# Altium schematic sheet 4. ADC.SchDoc
size A4
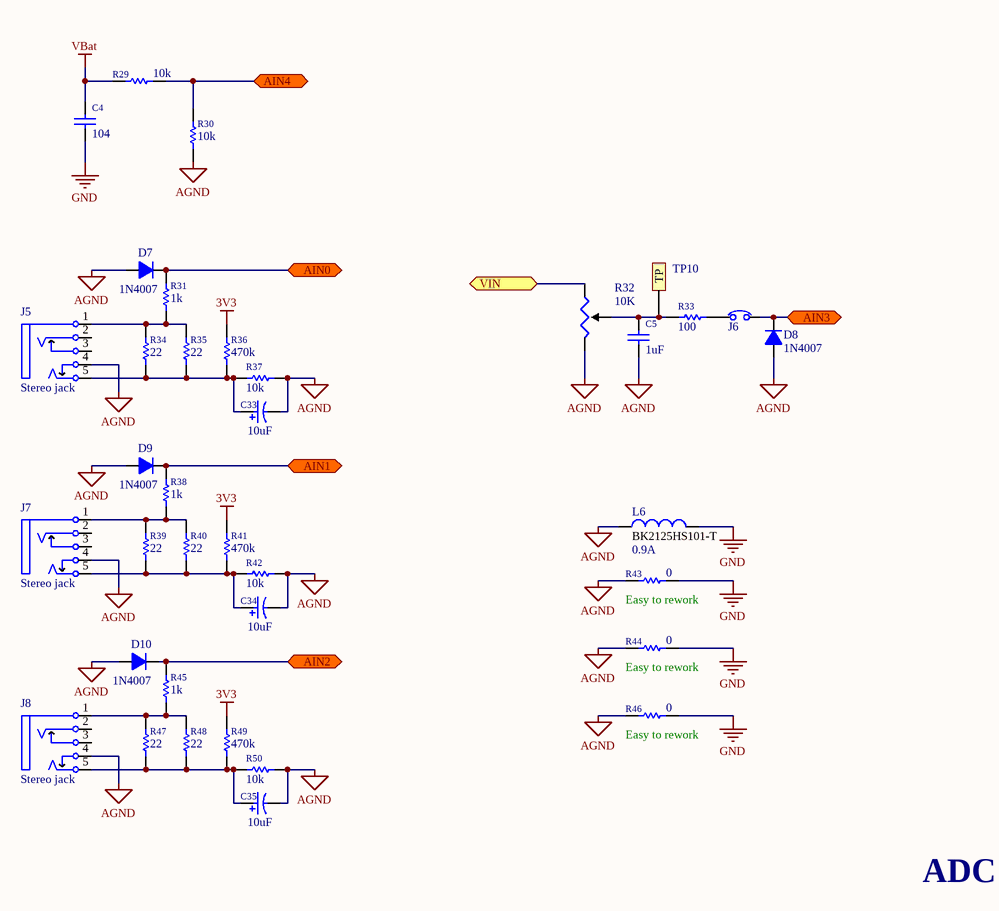
[diagram p0: 4. ADC.SchDoc]

## Parts
C4  104  [sm-0603-c]
C5  value 1uF  [sm-0603-c]  (hidden comment: 104)
C33  value 10uF  [Cap SMD Tant 10u]  (hidden comment: 10u)
C34  value 10uF  [Cap SMD Tant 10u]  (hidden comment: 10u)
C35  value 10uF  [Cap SMD Tant 10u]  (hidden comment: 10u)
D7  1N4007  [SOD-123]
D8  1N4007  [SOD-123]
D9  1N4007  [SOD-123]
D10  1N4007  [SOD-123]
J5  Stereo jack  [Audio Stereo Jack]
J6  jumper selector  [CON.HDR1X2]  (value not drawn)
J7  Stereo jack  [Audio Stereo Jack]
J8  Stereo jack  [Audio Stereo Jack]
L6  Current: 0.9A  [L2012-0805]  (hidden comment: BK2125HS101-T)
R29  10k  [SM-0603-R]
R30  10k  [SM-0603-R]
R31  value 1k  [SM-0603-R]  (hidden comment: 10k)
R32  value 10K  [TRIM Rect]  (hidden comment: Trimmer)
R33  value 100  [SM-0603-R]  (hidden comment: 470k)
R34  value 22  [SM-RES-1206]  (hidden comment: 10k)
R35  22  [SM-0603-R]
R36  value 470k  [SM-0603-R]  (hidden comment: 10k)
R37  value 10k  [SM-0603-R]  (hidden comment: 470k)
R38  value 1k  [SM-0603-R]  (hidden comment: 10k)
R39  value 22  [SM-RES-1206]  (hidden comment: 10k)
R40  22  [SM-0603-R]
R41  value 470k  [SM-0603-R]  (hidden comment: 10k)
R42  value 10k  [SM-0603-R]  (hidden comment: 470k)
R43  0  [R2012-0805]
R44  0  [R2012-0805]
R45  value 1k  [SM-0603-R]  (hidden comment: 10k)
R46  0  [R2012-0805]
R47  value 22  [SM-RES-1206]  (hidden comment: 10k)
R48  22  [SM-0603-R]
R49  value 470k  [SM-0603-R]  (hidden comment: 10k)
R50  value 10k  [SM-0603-R]  (hidden comment: 470k)
TP10  4V3_PG  [TP]  (value not drawn)  (no BOM)

## Ports
AIN0, AIN1, AIN2, AIN3, AIN4, VIN

## Nets
3V3: R36.2 R41.2 R49.2
AGND: C5.2 C33.2 C34.2 C35.2 D7.1(A) D8.1(A) D9.1(A) D10.1(A) J5.4(R2) J7.4(R2) J8.4(R2) L6.1 R30.1 R32.3 R37.1 R42.1 R43.1 R44.1 R46.1 R50.1
GND: C4.2 L6.2 R43.2 R44.2 R46.2
VBat: C4.1 R29.1
AIN0: D7.2(K) R31.2 ; port AIN0
AIN1: D9.2(K) R38.2 ; port AIN1
AIN2: D10.2(K) R45.2 ; port AIN2
AIN3: D8.2(K) J6.2 ; port AIN3
AIN4: R29.2 R30.2 ; port AIN4
VIN: R32.1 ; port VIN
NetC5_1: C5.1 R32.2 R33.2 TP10.1(TP)
NetC33_1: C33.1 J5.5(S2) R34.1 R35.1 R36.1 R37.2
NetC34_1: C34.1 J7.5(S2) R39.1 R40.1 R41.1 R42.2
NetC35_1: C35.1 J8.5(S2) R47.1 R48.1 R49.1 R50.2
NetJ5_1: J5.1(GND) R31.1 R34.2 R35.2
NetJ6_1: J6.1 R33.1
NetJ7_1: J7.1(GND) R38.1 R39.2 R40.2
NetJ8_1: J8.1(GND) R45.1 R47.2 R48.2

Not connected (* = marked no-connect by the designer): J5 2(S1) 3(R1); J7 2(S1) 3(R1); J8 2(S1) 3(R1)

## Notes on the sheet
- (near R43) Easy to rework
- (near R44) Easy to rework
- (near R46) Easy to rework
- ADC

## Library data of the parts
C4 C5 = Capacitor: CAP CER 10000PF 16V 0603; Manufacturer: Taiyo Yuden; Manufacturer P/N: EMK107SD103JA-T; Vendor: DIGIKEY; Vendor P/N: 587-1093-1-ND; Package: 0603; Part: EMK107SD103JA-T; Voltage: 16V
  C4: Value: 104
C33-C35 = Cap_Pol: CAP CER 10UF 6.3V X5R 1206; Manufacturer: Samsung Electro-Mechanics; Manufacturer P/N: CL31A106MQHNNNE; Vendor: DIGIKEY; Vendor P/N: 1276-3045-1-ND; Tollerance: 20%; Voltage: 6.3V; Part: 10u; Package: 1206; DNP: *
D7-D10 = Diode 1N4007: DIODE 100V/1A; Manufacturer: TOSHIBA; Vendor P/N: 1N4007-M7; Voltage: 100V; Current: 1A; Vendor: www.tme.vn; Value: 1N4007; Price: 500 VND; Part: Diode 1N4007; Manufacturer P/N: 1N4007-M7; Package: DO-214AC; DNP: *
J5 J7 J8 = Audio Jack: Stereo audio jack
L6 = Inductor: FERRITE BEAD 100 OHM 0805 1LN; Manufacturer: Taiyo Yuden; Vendor: DIGIKEY; Vendor P/N: 587-1903-1-ND; Res: 100 OHM; Value: BK2125HS101-T; DNP: *; Manufacturer P/N: BK2125HS101-T; Package: 0805; Part: BK2125HS101-T; Price: *
R29-R31 R33-R42 R45 R47-R50 = Resistor: RES SMD 10K OHM 5% 1/10W 0603; Manufacturer: Panasonic Electronic Components; Manufacturer P/N: ERJ-3GEYJ103V; Vendor: DIGIKEY; Vendor P/N: P10KGCT-ND; Tollerance: 5%; Part: 10k; Package: 0603; Power: 1/10W; DNP: *
  R29 R30: Value: 10k
  R35 R40 R48: Value: 22
R32 = Trimmer: Res var, Rectangle Trimmer; Vendor: Nhat Tao - IC Thuan; Published: 8-Jun-2000; LatestRevisionDate: 04-Mar-2005; LatestRevisionNote: PCB Footprint replaced.; PackageReference: J1-0603; ComponentLink1Description: Digikey Part Link; ComponentLink2Description: Open Datasheet; ComponentLink2URL: H:\LIBRARY\LIBRARY.Datasheet\; Price: 2000 VND; Date of Price: 19/11/2010; Part: Trimmer
R43 R44 R46 = Resistor: RES SMD 0 OHM JUMPER 1/10W 0805; Manufacturer: Panasonic Electronic Components; Manufacturer P/N: ERJ-6GEY0R00V; Vendor: DIGIKEY; Vendor P/N: P0.0ACT-ND; Tollerance: 5%; Part: 0; Value: 0; Package: 0805; Power: 1/10W
TP10 = TP: Test Point
J6 = jumper selector: ComponentLink2Description: Open Datasheet; Price: 500 VND; Date of Price: 19/11/2010; Part: jumper selector